# EAGLE design AbercrombieBlockage2 (EAGLE 7.4.0)
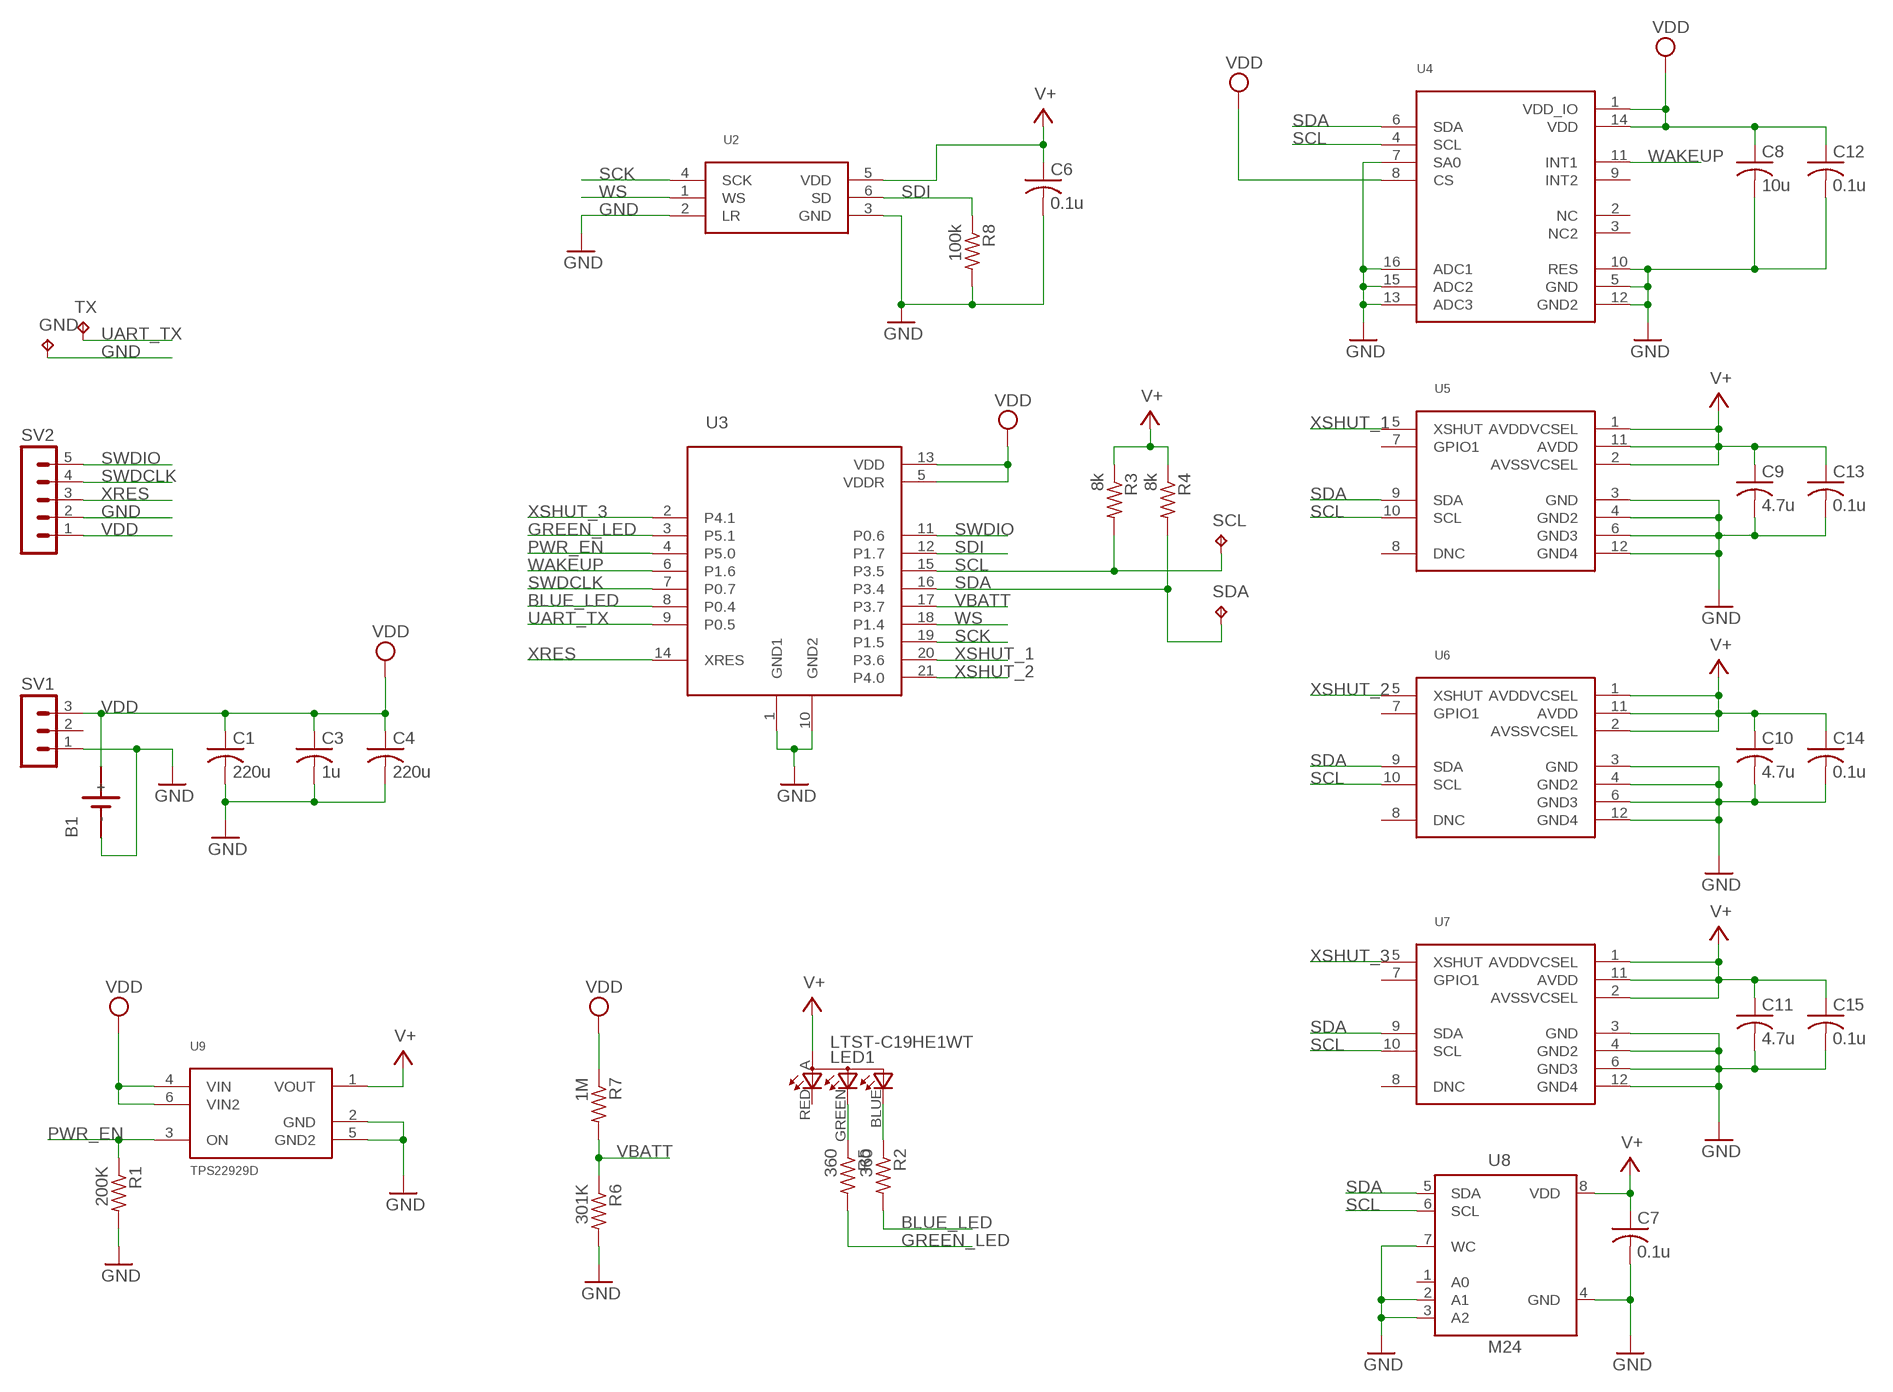
[diagram p0: schematic, sheet 1]

## Parts
B1  BU2032  [BU2032]
C1  220u  C-USC1210  [C1210]
C3  1u  C-USC0603  [C0603]
C4  220u  C-USC1210  [C1210]
C6  0.1u  C-USC0603  [C0603]
C7  0.1u  C-USC0603  [C0603]
C8  10u  C-USC0603  [C0603]
C9  4.7u  C-USC0603  [C0603]
C10  4.7u  C-USC0603  [C0603]
C11  4.7u  C-USC0603  [C0603]
C12  0.1u  C-USC0603  [C0603]
C13  0.1u  C-USC0603  [C0603]
C14  0.1u  C-USC0603  [C0603]
C15  0.1u  C-USC0603  [C0603]
GND  TPB1,27  [B1,27]
LED1  LTST-C19HE1WT  [LTST-C19HE1WT]
R1  200K  R-US_R0603  [R0603]
R2  360  R-US_R0603  [R0603]
R3  8k  R-US_R0603  [R0603]
R4  8k  R-US_R0603  [R0603]
R5  360  R-US_R0603  [R0603]
R6  301K  R-US_R0603  [R0603]
R7  1M  R-US_R0603  [R0603]
R8  100k  R-US_R0603  [R0603]
SCL  TPB1,27  [B1,27]
SDA  TPB1,27  [B1,27]
SV1  MA03-1  [MA03-1]
SV2  MA05-1  [MA05-1]
TX  TPB1,27  [B1,27]
U2  ICS-43434  [ICS-43434]
U3  CYBLE-022001-00  [CYBLE-022001-00]
U4  LIS3DH  [LGA-16]
U5  VL53L0X  [VL53L0X]
U6  VL53L0X  [VL53L0X]
U7  VL53L0X  [VL53L0X]
U8  M24  [SO-08]
U9  TPS22929D  [SOT-23-6]

## Nets
BLUE_LED: R2.2 U3.8(P0.4)
GND: B1.NEG(-) C1.2 C3.2 C4.2 C6.2 C7.2 C8.2 C9.2 C10.2 C11.2 C12.2 C13.2 C14.2 C15.2 GND.TP R1.2 R6.2 R8.2 SV1.1 SV2.2 U2.2(LR) U2.3(GND) U3.1(GND1) U3.10(GND2) U4.5(GND) U4.7(SA0) U4.10(RES) U4.12(GND2) U4.13(ADC3) U4.15(ADC2) U4.16(ADC1) U5.3(GND) U5.4(GND2) U5.6(GND3) U5.12(GND4) U6.3(GND) U6.4(GND2) U6.6(GND3) U6.12(GND4) U7.3(GND) U7.4(GND2) U7.6(GND3) U7.12(GND4) U8.2(A1) U8.3(A2) U8.4(GND) U8.7(WC) U9.2(GND) U9.5(GND2)
GREEN_LED: R5.2 U3.3(P5.1)
N$1: LED1.BLUE(CBLUE) R2.1
N$3: LED1.GREEN(CGREEN) R5.1
PWR_EN: R1.1 U3.4(P5.0) U9.3(ON)
SCK: U2.4(SCK) U3.19(P1.5)
SCL: R3.2 SCL.TP U3.15(P3.5) U4.4(SCL) U5.10(SCL) U6.10(SCL) U7.10(SCL) U8.6(SCL)
SDA: R4.2 SDA.TP U3.16(P3.4) U4.6(SDA) U5.9(SDA) U6.9(SDA) U7.9(SDA) U8.5(SDA)
SDI: R8.1 U2.6(SD) U3.12(P1.7)
SWDCLK: SV2.4 U3.7(P0.7)
SWDIO: SV2.5 U3.11(P0.6)
UART_TX: TX.TP U3.9(P0.5)
V+: C6.1 C7.1 C9.1 C10.1 C11.1 C13.1 C14.1 C15.1 LED1.A R3.1 R4.1 U2.5(VDD) U5.1(AVDDVCSEL) U5.2(AVSSVCSEL) U5.11(AVDD) U6.1(AVDDVCSEL) U6.2(AVSSVCSEL) U6.11(AVDD) U7.1(AVDDVCSEL) U7.2(AVSSVCSEL) U7.11(AVDD) U8.8(VDD) U9.1(VOUT)
VBATT: R6.1 R7.2 U3.17(P3.7)
VDD: B1.PLUS(+) C1.1 C3.1 C4.1 C8.1 C12.1 R7.1 SV1.3 SV2.1 U3.5(VDDR) U3.13(VDD) U4.1(VDD_IO) U4.8(CS) U4.14(VDD) U9.4(VIN) U9.6(VIN2)
WAKEUP: U3.6(P1.6) U4.11(INT1)
WS: U2.1(WS) U3.18(P1.4)
XRES: SV2.3 U3.14(XRES)
XSHUT_1: U3.20(P3.6) U5.5(XSHUT)
XSHUT_2: U3.21(P4.0) U6.5(XSHUT)
XSHUT_3: U3.2(P4.1) U7.5(XSHUT)
Unconnected: LED1.RED(CRED) SV1.2 U4.2(NC) U4.3(NC2) U4.9(INT2) U5.7(GPIO1) U5.8(DNC) U6.7(GPIO1) U6.8(DNC) U7.7(GPIO1) U7.8(DNC) U8.1(A0)

## Library data of the parts
B1 = NicksParts:BU2032: BU2032 battery holder
C1 = resistor:C-US: CAPACITOR, American symbol; DIGIKEYY: 490-13250-1-ND
C3 C4 C6-C15 = resistor:C-US: CAPACITOR, American symbol
GND SCL SDA TX = testpad:TP: Test pad
LED1 = NicksParts:LTST-C19HE1WT; DIGIKEY: 160-2162-1-ND
R1-R8 = resistor:R-US_: RESISTOR, American symbol
SV1 = con-lstb:MA03-1: PIN HEADER; OC_FARNELL: unknown; OC_NEWARK: unknown
SV2 = con-lstb:MA05-1: PIN HEADER; DIGIKEY: 952-2246-ND; OC_FARNELL: unknown; OC_NEWARK: unknown
U2 = NicksParts:ICS-43434: Invensense I2S MEMS microphone; DIGIKEY: 1428-1066-1-ND
U3 = NicksParts:CYBLE-022001-00: This is a Cypress pre-certified BLE module.; DIGIKEY: 428-3566-PROMO-ND
U4 = NicksParts:LIS3DH: 3 axis low power accelerometer from ST. Supports movement detection.; DIGIKEY: 497-10613-1-ND
U5-U7 = NicksParts:VL53L0X: ST Laser rangefinder; DIGIKEY: 497-16538-1-ND
U8 = NicksParts:M24: ST I2C EEPROM Devices; DIGIKEY: 497-6351-1-ND
U9 = NicksParts:TPS22929D: Low resistance load switch

## Board
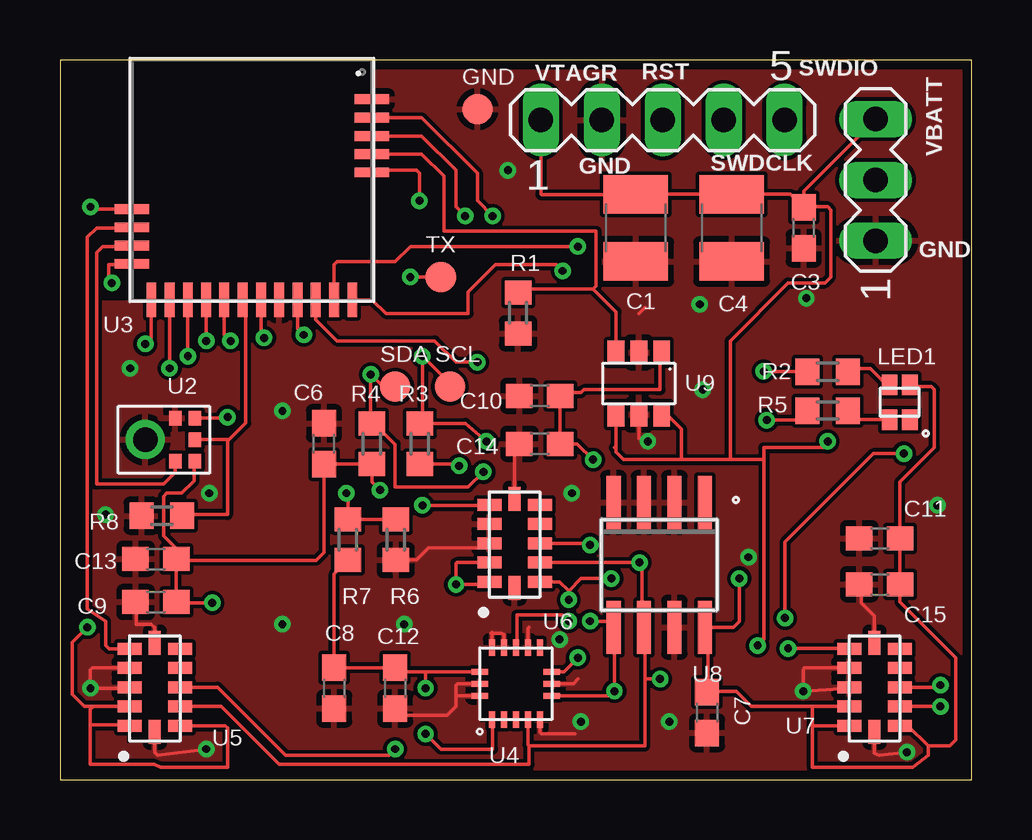
[diagram p1: board, top side]
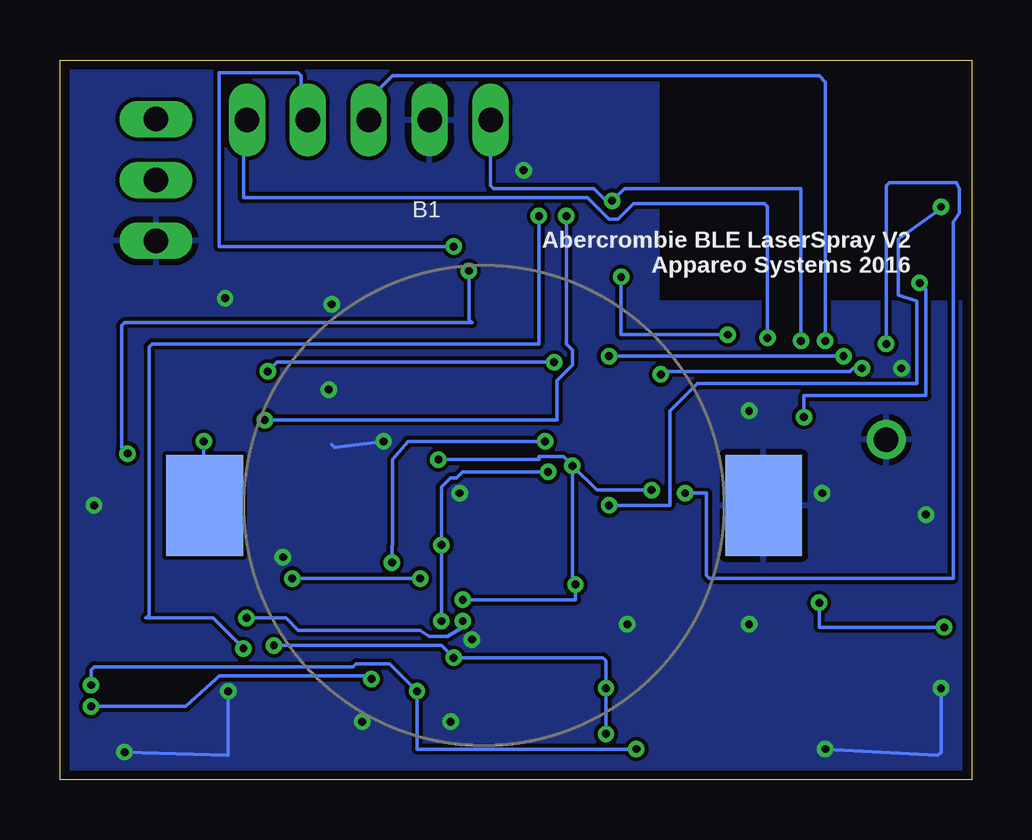
[diagram p2: board, bottom side, seen from below]

Size 38 x 30 mm. Coordinates in mm from the lower left corner, seen from the top.
Outline: 38,0 38,30 0,30 0,0 38,0
Copper layers (1*16): Top 0.0356mm / dielectric 1.5011mm / Bottom 0.0356mm
Design rules "oshpark-2layer": minimum track width 6mil, minimum drill 13mil, track to track 6mil, track to pad 6mil, pad to pad 6mil, via to via 6mil, smd to smd 6mil, copper to edge 15mil, drill to drill 6mil, minimum pad ring 7mil, minimum via ring 7mil, stop-mask expansion 4mil, vias tented up to drill 0mil, thermal gap 10mil
tRestrict: area 2.8,1.5 to 5,6; area 0,20 to 13,30; area 17.9,7.6 to 20,12; area 33,1.6 to 35,6; area 17.5,2.4 to 20.4,5.5
bRestrict: area 0,20 to 13,30

### Footprints (pad centres in the part's own frame; a part is rotated, then mirrored left to right if it is on the bottom)
BU2032 = smd 3.2 x 4.2: NEG 11.65,0; PLUS -11.65,0
C1210 = smd 1.6 x 2.7: 1 -1.4,0; 2 1.4,0
C0603 = smd 1.1 x 1: 1 -0.85,0; 2 0.85,0
B1,27 = smd 1.27 x 1.27: TP 0,0
LTST-C19HE1WT = smd 0.65 x 0.85: A -0.425,-0.725; BLUE 0.425,-0.725; GREEN 0.425,0.725; RED -0.425,0.725
R0603 = smd 1 x 1.1: 1 -0.85,0; 2 0.85,0
MA03-1 = drill 1.016 long: 1 -2.54,0; 2 0,0; 3 2.54,0
MA05-1 = drill 1.016 long: 1 -5.08,0; 2 -2.54,0; 3 0,0; 4 2.54,0; 5 5.08,0
ICS-43434 = smd 0.522 x 0.6: 1 0,-0.9; 2 0.822,-0.9; 4 0.822,0.9; 5 0,0.9; 6 0,0 | drill 1.025 pad 1.625: 3 2.074,0
CYBLE-022001-00 = smd 1.42 x 0.41: 1 5,3.36; 2 5,2.59; 3 5,1.83; 4 5,1.07; 5 5,0.31; 18 -5,-3.5; 19 -5,-2.74; 20 -5,-1.98; 21 -5,-1.22 | smd 0.41 x 1.42: 6 4.19,-5; 7 3.43,-5; 8 2.66,-5; 9 1.9,-5; 10 1.14,-5; 11 0.38,-5; 12 -0.38,-5; 13 -1.15,-5; 14 -1.91,-5; 15 -2.67,-5; 16 -3.43,-5; 17 -4.19,-5
LGA-16 = smd 0.7 x 0.25: 1 -1.5,1; 2 -1.5,0.5; 3 -1.5,0; 4 -1.5,-0.5; 5 -1.5,-1; 9 1.5,-1; 10 1.5,-0.5; 11 1.5,0; 12 1.5,0.5; 13 1.5,1 | smd 0.25 x 0.7: 6 -0.5,-1.5; 7 0,-1.5; 8 0.5,-1.5; 14 0.5,1.5; 15 0,1.5; 16 -0.5,1.5
VL53L0X = smd 0.5 x 1: 1 0.25,2.1; 2 1.05,2.1; 3 1.85,2.1; 4 2.65,2.1; 5 3.45,2.1; 7 3.45,0; 8 2.65,0; 9 1.85,0; 10 1.05,0; 11 0.25,0 | smd 1 x 0.5: 6 3.7,1.05; 12 0,1.05
SO-08 = smd 0.6 x 2.2: 1 -1.905,-2.6; 2 -0.635,-2.6; 3 0.635,-2.6; 4 1.905,-2.6; 5 1.905,2.6; 6 0.635,2.6; 7 -0.635,2.6; 8 -1.905,2.6
SOT-23-6 = smd 0.7 x 1: 1 -0.95,-1.3; 2 0,-1.3; 3 0.95,-1.3; 4 0.95,1.3; 5 0,1.3; 6 -0.95,1.3

### Placement (x,y rotation side)
B1  20.32,11.43 0 bottom
C1  24,23 270 top
C3  31,23 270 top
C4  28,23 270 top
C6  11,14 90 top
C7  26.97,2.79 270 top
C8  11.43,3.81 270 top
C9  4,7.4 180 top
C10  20,16 180 top
C11  34.17,10.06 180 top
C12  13.97,3.81 270 top
C13  4,9.2 180 top
C14  20,14 180 top
C15  34.17,8.14 180 top
GND  17.4,27.94 0 top
LED1  35,15.73 180 top
R1  19.1,19.45 270 top
R2  32,17 180 top
R3  15,14 90 top
R4  13,14 90 top
R5  32,15.38 180 top
R6  14,10 270 top
R7  12,10 90 top
R8  4.25,11 180 top
SCL  16.26,16.38 0 top
SDA  13.97,16.38 0 top
SV1  34,25 90 top
SV2  25.13,27.49 0 top
TX  15.88,20.95 0 top
U2  5.63,14.17 180 top
U3  8,25 0 top
U4  19,4 90 top
U5  5,2 90 top
U6  20,8 90 top
U7  35,2 90 top
U8  24.98,8.95 180 top
U9  24.13,16.51 180 top

### Tracks (layer width: path | path; a pad name or v marks a point on that pad's centre or on a via)
BLUE_LED  (via drill 0.33)
  Top 0.152: U3.8 10.66,19.18 11.56,18.29 15.62,18.29 16.51,17.4 v17.4,17.4 | v29.34,17.02 31.13,17.02 R2.2
  Bottom 0.152: v17.4,17.4 28.96,17.4 v29.34,17.02
GND  (via drill 0.33)
  Top 0.152: U5.12 3.95,1.13 4.06,1.02 v6.1,1.27 | U5.3 2.86,3.81 v1.27,3.81 1.27,4.57 1.35,4.65 U5.4 | U5.6 3.95,6.34 3.81,6.48 3.17,6.48 3.17,7.38 C9.2 | U4.16 16.58,3.5 | 16.58,3.5 16.51,3.43 16.51,3.05 16.13,2.67 14.26,2.67 C12.2 | U4.5 20,1.97 20.07,1.91 21.46,1.91 | U4.7 21.4,4 21.59,4.19 | R6.2 14.87,9.15 15.37,9.65 17.7,9.65 U6.3 | U6.6 18.95,13.8 C14.2 | U4.15 16.57,4 16.51,3.94 16.51,3.44 16.58,3.5 | U4.13 18,6.13 | 18,6.13 18.03,6.1 | U4.12 18.5,6.05 18.41,6.1 18.03,6.1 | 18.03,6.1 17.97,6.1 18,6.13 | U7.12 33.95,1.1 34.16,1.02 v35.31,1.14 | U7.3 32.86,3.81 v30.99,3.68 30.99,4.57 31.04,4.65 U7.4 | U7.6 33.95,6.82 33.4,7.37 33.4,8.06 C15.2 | 24.13,19.43 24.38,19.68 | U9.5 24.13,14.22 v24.51,14.1 | U4.10 19.5,6.29 19.56,6.35
  Bottom 0.152: v6.1,1.27 1.4,1.02 1.27,1.14 v1.27,3.81 | v35.31,1.14 30.99,1.02 v30.99,3.68 | v24.51,14.1 26.54,13.84 26.67,13.97
  other vias: 9.27,15.37 9.27,6.48 14.35,6.48 18.67,25.4 6.22,11.94 2.92,17.14 21.72,2.41 25.4,2.41 28.7,9.27 31.11,20.07 36.58,11.43 21.34,11.94 26.8,16.26 26.67,19.81 1.91,11.05 20.83,5.84
  pour Bottom: 0,0 38.1,0 38.1,29.72 37.97,29.84 0.13,29.84 0.13,0.13
  pour Top: 0,0 38,0 38,30 0,30
GREEN_LED  (via drill 0.33)
  Top 0.152: U3.3 15.08,26.83 16.51,25.4 16.51,23.88 v16.89,23.5 | v29.46,14.99 31.14,14.99 R5.2
  Bottom 0.152: v16.89,23.5 16.89,18.16 16.64,17.91 16.64,17.27 17.27,16.64 17.27,14.99 v29.46,14.99
N$1
  Top 0.152: LED1.BLUE 34.47,16.45 33.78,17.14 32.99,17.14 R2.1
N$3
  Top 0.152: LED1.GREEN 32.85,15.01 R5.1
PWR_EN
  Top 0.152: U3.4 15.08,26.07 16,25.15 16,22.86 22.35,22.86 22.35,20.57 22.23,20.45 | 22.23,20.45 19.24,20.45 R1.1 | U9.3 23.18,19.49 22.23,20.45
SCK
  Top 0.152: U3.19 2.96,22.23 1.78,22.23 1.52,21.97 1.52,12.32 4.32,12.32 4.81,12.81 U2.4
SCL  (via drill 0.33)
  Top 0.152: U4.4 19.5,1.46 19.56,1.4 | 19.56,1.4 24.38,1.4 24.38,4.19 | 24.38,4.19 24.38,6.31 U8.6 24.26,6.44 24.26,8.89 v24.16,9.05 U6.10 | U5.10 6.73,3.05 9.14,0.64 19.56,0.64 19.56,1.4 | U3.15 v5.33,17.66 v5.33,17.65 | SCL.TP 16.26,16.51 v15.11,17.65 15.11,14.96 R3.2 16.9,14.85 v17.78,14.1 | U7.10 36.83,3.05 v36.7,3.05 | v25.02,4.19 24.38,4.19
  Bottom 0.152: v5.33,17.65 v15.11,17.65 | v17.78,14.1 23.5,14.1 24.13,13.34 24.13,9.78 24.16,9.75 v24.16,9.05 | v36.7,3.05 32.77,3.05 31.5,4.19 31.37,4.32 25.15,4.32 v25.02,4.19
SDA  (via drill 0.33)
  Top 0.152: U4.6 22.93,3.5 | 22.93,3.5 v23.11,3.68 | v23.11,3.68 23.11,6.31 U8.5 22.82,6.6 v22.1,6.6 | U6.9 21.9,9.85 v22.1,9.78 | U5.9 6.56,3.85 9.4,1.02 13.72,1.02 v13.97,1.27 | 22.93,3.5 22.93,3.48 v23.11,3.68 | U3.16 v4.57,17.15 v4.57,17.14 | SDA.TP 13.46,16.38 v12.95,16.89 12.95,14.9 R4.2 13.09,14.85 13.97,13.97 13.97,12.19 17.02,12.19 v17.65,12.83 | U7.9 36.62,3.85 v36.7,3.94
  Bottom 0.152: v22.1,6.6 v22.1,9.78 22.1,12.19 21.72,12.57 21.46,12.57 21.21,12.83 v17.65,12.83 | v13.97,1.27 23.11,1.27 v23.11,3.68 24.26,4.83 25.65,4.83 25.78,4.7 36.58,4.7 36.7,4.57 v36.7,3.94 | 12.7,17.02 v12.95,16.89 12.83,17.02 5.08,17.02 4.95,17.14 v4.57,17.14
SDI
  Top 0.152: U3.12 7.75,19.87 7.75,14.86 7.06,14.17 U2.6 6.93,14.17 6.99,14.1 6.99,11.05 5.15,11.05 R8.1
SWDCLK  (via drill 0.33)
  Top 0.152: U3.7 11.43,21.46 11.56,21.59 13.97,21.59 14.61,22.23 v21.59,22.23
  Bottom 0.152: v21.59,22.23 31.37,22.23 31.37,29.46 28.07,29.46 27.94,29.34 27.94,27.77 SV2.4
SWDIO  (via drill 0.33)
  Top 0.152: U3.11 8.38,18.54 v8.51,18.41
  Bottom 0.152: v8.51,18.41 8.51,23.88 8.64,24 14.1,24 14.73,23.37 15.11,23.37 16,24.26 30.35,24.26 30.35,27.35 SV2.5
UART_TX  (via drill 0.33)
  Top 0.152: U3.9 9.9,18.8 v10.16,18.54 | v14.61,20.95 TX.TP
  Bottom 0.152: v10.16,18.54 14.61,18.54 v14.61,20.95
V+  (via drill 0.33)
  Top 0.152: 1.27,2.29 1.27,2.92 1.4,3.05 U5.2 1.01,3.05 0.51,3.56 0.51,5.71 v1.14,6.35 | 1.27,2.29 2.86,2.29 U5.1 | U5.11 6.89,2.25 6.99,2.16 6.99,0.51 4.19,0.51 3.94,0.64 1.27,0.64 1.27,2.29 | v6.35,7.37 4.88,7.37 C9.1 C13.1 | U6.11 20.83,8.25 21.21,7.87 | U6.1 17.78,8.13 v16.51,8.13 16.51,9.02 16.54,9.05 U6.2 | R3.1 16.57,13.15 v16.64,13.08 | C13.1 4.85,9.63 4.32,10.16 4.32,11.81 4.45,11.94 5.08,11.94 5.59,12.45 5.59,13.23 U2.5 | C13.1 4.91,9.14 10.67,9.14 11,9.48 C6.1 R4.1 13,12.4 v13.34,12.06 | U9.1 25.02,17.5 25.02,16.26 24.89,16.25 21.84,16.25 21.72,16.13 20.98,16.13 C10.1 C14.1 21.56,14 v22.23,13.34 | U7.2 31.37,3.05 | 31.37,3.05 28.83,3.05 28.19,3.68 27.01,3.68 | 27.01,3.68 C7.1 | U7.1 31.41,2.25 | 31.41,2.25 31.37,2.29 31.37,3.05 | U7.11 35.34,2.25 36.2,1.4 | 36.2,1.4 36.2,1.02 35.56,0.51 31.37,0.51 31.37,2.21 31.41,2.25 | 36.2,1.4 37.08,1.4 37.34,1.65 37.34,5.08 35.02,7.4 C15.1 C11.1 35.02,12.41 36.45,13.84 36.45,16.26 36.32,16.38 35.5,16.38 LED1.A | 27.01,3.68 27.01,6.22 U8.8 28.07,6.35 28.32,6.6 v28.32,8.38 | v21.21,7.49 21.21,7.87 | 21.21,7.87 21.72,8.38 v22.99,8.38
  Bottom 0.152: v1.14,6.35 6.35,6.35 v6.35,7.37 | v21.21,7.49 16.51,7.49 v16.51,8.13 16.64,8.26 v16.64,13.08 | v22.23,13.34 18.03,13.34 18.03,13.46 17.02,13.46 v16.64,13.08 | v13.34,12.06 15.62,12.06 v16.64,13.08 | v22.99,8.38 v28.32,8.38
VBATT  (via drill 0.33)
  Top 0.152: R6.1 R7.2 12,11.88 v11.94,11.94 | U3.17 3.81,18.41 v3.56,18.16
  Bottom 0.152: v11.94,11.94 11.05,11.94 11.05,8.51 10.92,8.38 0.76,8.38 0.76,23.24 0.51,23.62 0.51,24.64 0.64,24.89 3.43,24.89 3.56,24.77 v3.56,18.16
VDD  (via drill 0.33)
  Top 0.152: R7.1 11.43,8.58 C8.1 C12.1 14.13,4.5 U4.14 15.29,4.5 15.24,4.45 v15.24,3.81 | U4.1 18.03,2.47 18.03,1.27 15.88,1.27 v15.24,1.91 | U4.8 21.01,4.5 v21.59,5.08 | U3.13 6.85,18.55 v7.11,18.29 | v14.99,24.13 14.99,25.27 14.86,25.4 13.09,25.4 U3.5 | SV2.1 20.05,24.4 20.07,24.38 23.98,24.38 C1.1 C4.1 30.45,24.4 C3.1 | C3.1 31,24.54 SV1.3 | U9.4 23.18,13.91 | 23.18,13.91 23.11,13.84 | 25.15,14.89 U9.6 25.3,15.21 25.91,14.61 25.91,13.34 | v32,14.1 31.88,13.84 29.34,13.84 29.34,13.34 | 27.94,13.34 27.94,18.29 30.35,20.7 31.88,20.7 32.13,20.95 32.13,23.75 32,23.88 31.03,23.88 C3.1 | 29.34,13.34 29.34,5.84 v29.08,5.59 | 23.18,13.91 23.18,13.65 23.5,13.34 25.91,13.34 | 25.91,13.34 27.94,13.34 | 27.94,13.34 29.34,13.34
  Bottom 0.152: v15.24,1.91 v15.24,3.81 15.24,4.95 15.37,5.08 v21.59,5.08 22.1,5.59 v29.08,5.59 | v7.11,18.29 7.11,24.64 14.48,24.64 v14.99,24.13 15.24,24.13 15.75,24.64 19.92,24.64 20.05,24.77 SV2.1 | v32,14.1 32,11.46 B1.PLUS
WAKEUP  (via drill 0.33)
  Top 0.152: U3.6 13.02,20 13.59,19.43 17.02,19.43 17.02,20.32 18.16,21.46 20.7,21.46 v20.95,21.21 | v35.18,13.59 33.91,13.59 30.23,9.91 v30.23,6.73 | U4.11 19.05,5.55 19.05,6.86 20.95,6.86 v21.21,6.6
  Bottom 0.152: v20.95,21.21 20.95,19.18 20.83,19.05 35.31,19.05 35.43,18.92 35.43,13.84 v35.18,13.59 | v30.23,6.73 28.57,6.73 28.07,6.22 22.99,6.22 22.61,5.97 21.84,5.97 21.21,6.35 v21.21,6.6
WS  (via drill 0.33)
  Top 0.152: U2.1 6.94,15.07 v6.99,15.11 | U3.18 2.96,21.46 2.03,21.46 2.03,20.83 v2.16,20.7
  Bottom 0.152: v6.99,15.11 6.99,16 1.91,16 1.91,20.45 v2.16,20.7
XRES  (via drill 0.33)
  Top 0.152: v6.1,18.29 U3.14
  Bottom 0.152: SV2.3 25.13,28.34 24.13,29.34 6.35,29.34 6.1,29.08 v6.1,18.29
XSHUT_1
  Top 0.152: U5.5 2.04,5.45 1.91,5.59 1.91,6.6 1.14,7.11 1.14,22.61 1.52,22.99 2.97,22.99 U3.20
XSHUT_2  (via drill 0.33)
  Top 0.152: v15.11,11.43 17.88,11.43 U6.5 | U3.21 1.37,23.78 v1.27,23.88
  Bottom 0.152: v15.11,11.43 12.57,11.43 12.57,15.37 11.43,16.51 2.29,16.51 2.29,19.94 3.05,20.19 3.05,22.54 1.3,23.78 1.3,23.84 v1.27,23.88
XSHUT_3  (via drill 0.33)
  Top 0.152: U3.2 15.08,27.59 17.4,25.27 17.4,24.13 v18.03,23.5 | v30.35,5.46 32.89,5.46 U7.5
  Bottom 0.152: v18.03,23.5 18.03,18.16 34.16,18.16 34.29,18.03 34.29,6.86 34.42,6.73 31.62,6.73 v30.35,5.46

### Text on the board
tNames: VTAGR | RST | SWDIO | VBATT | GND | SWDCLK | GND
bNames: Abercrombie BLE LaserSpray V2 / Appareo Systems 2016